# Altium schematic sheet Э3_2.SchDoc
size 420 x 297 mm; SheetNumber: 2; Scale: 1:1; DocumentType: Схема электрическая принципиальная
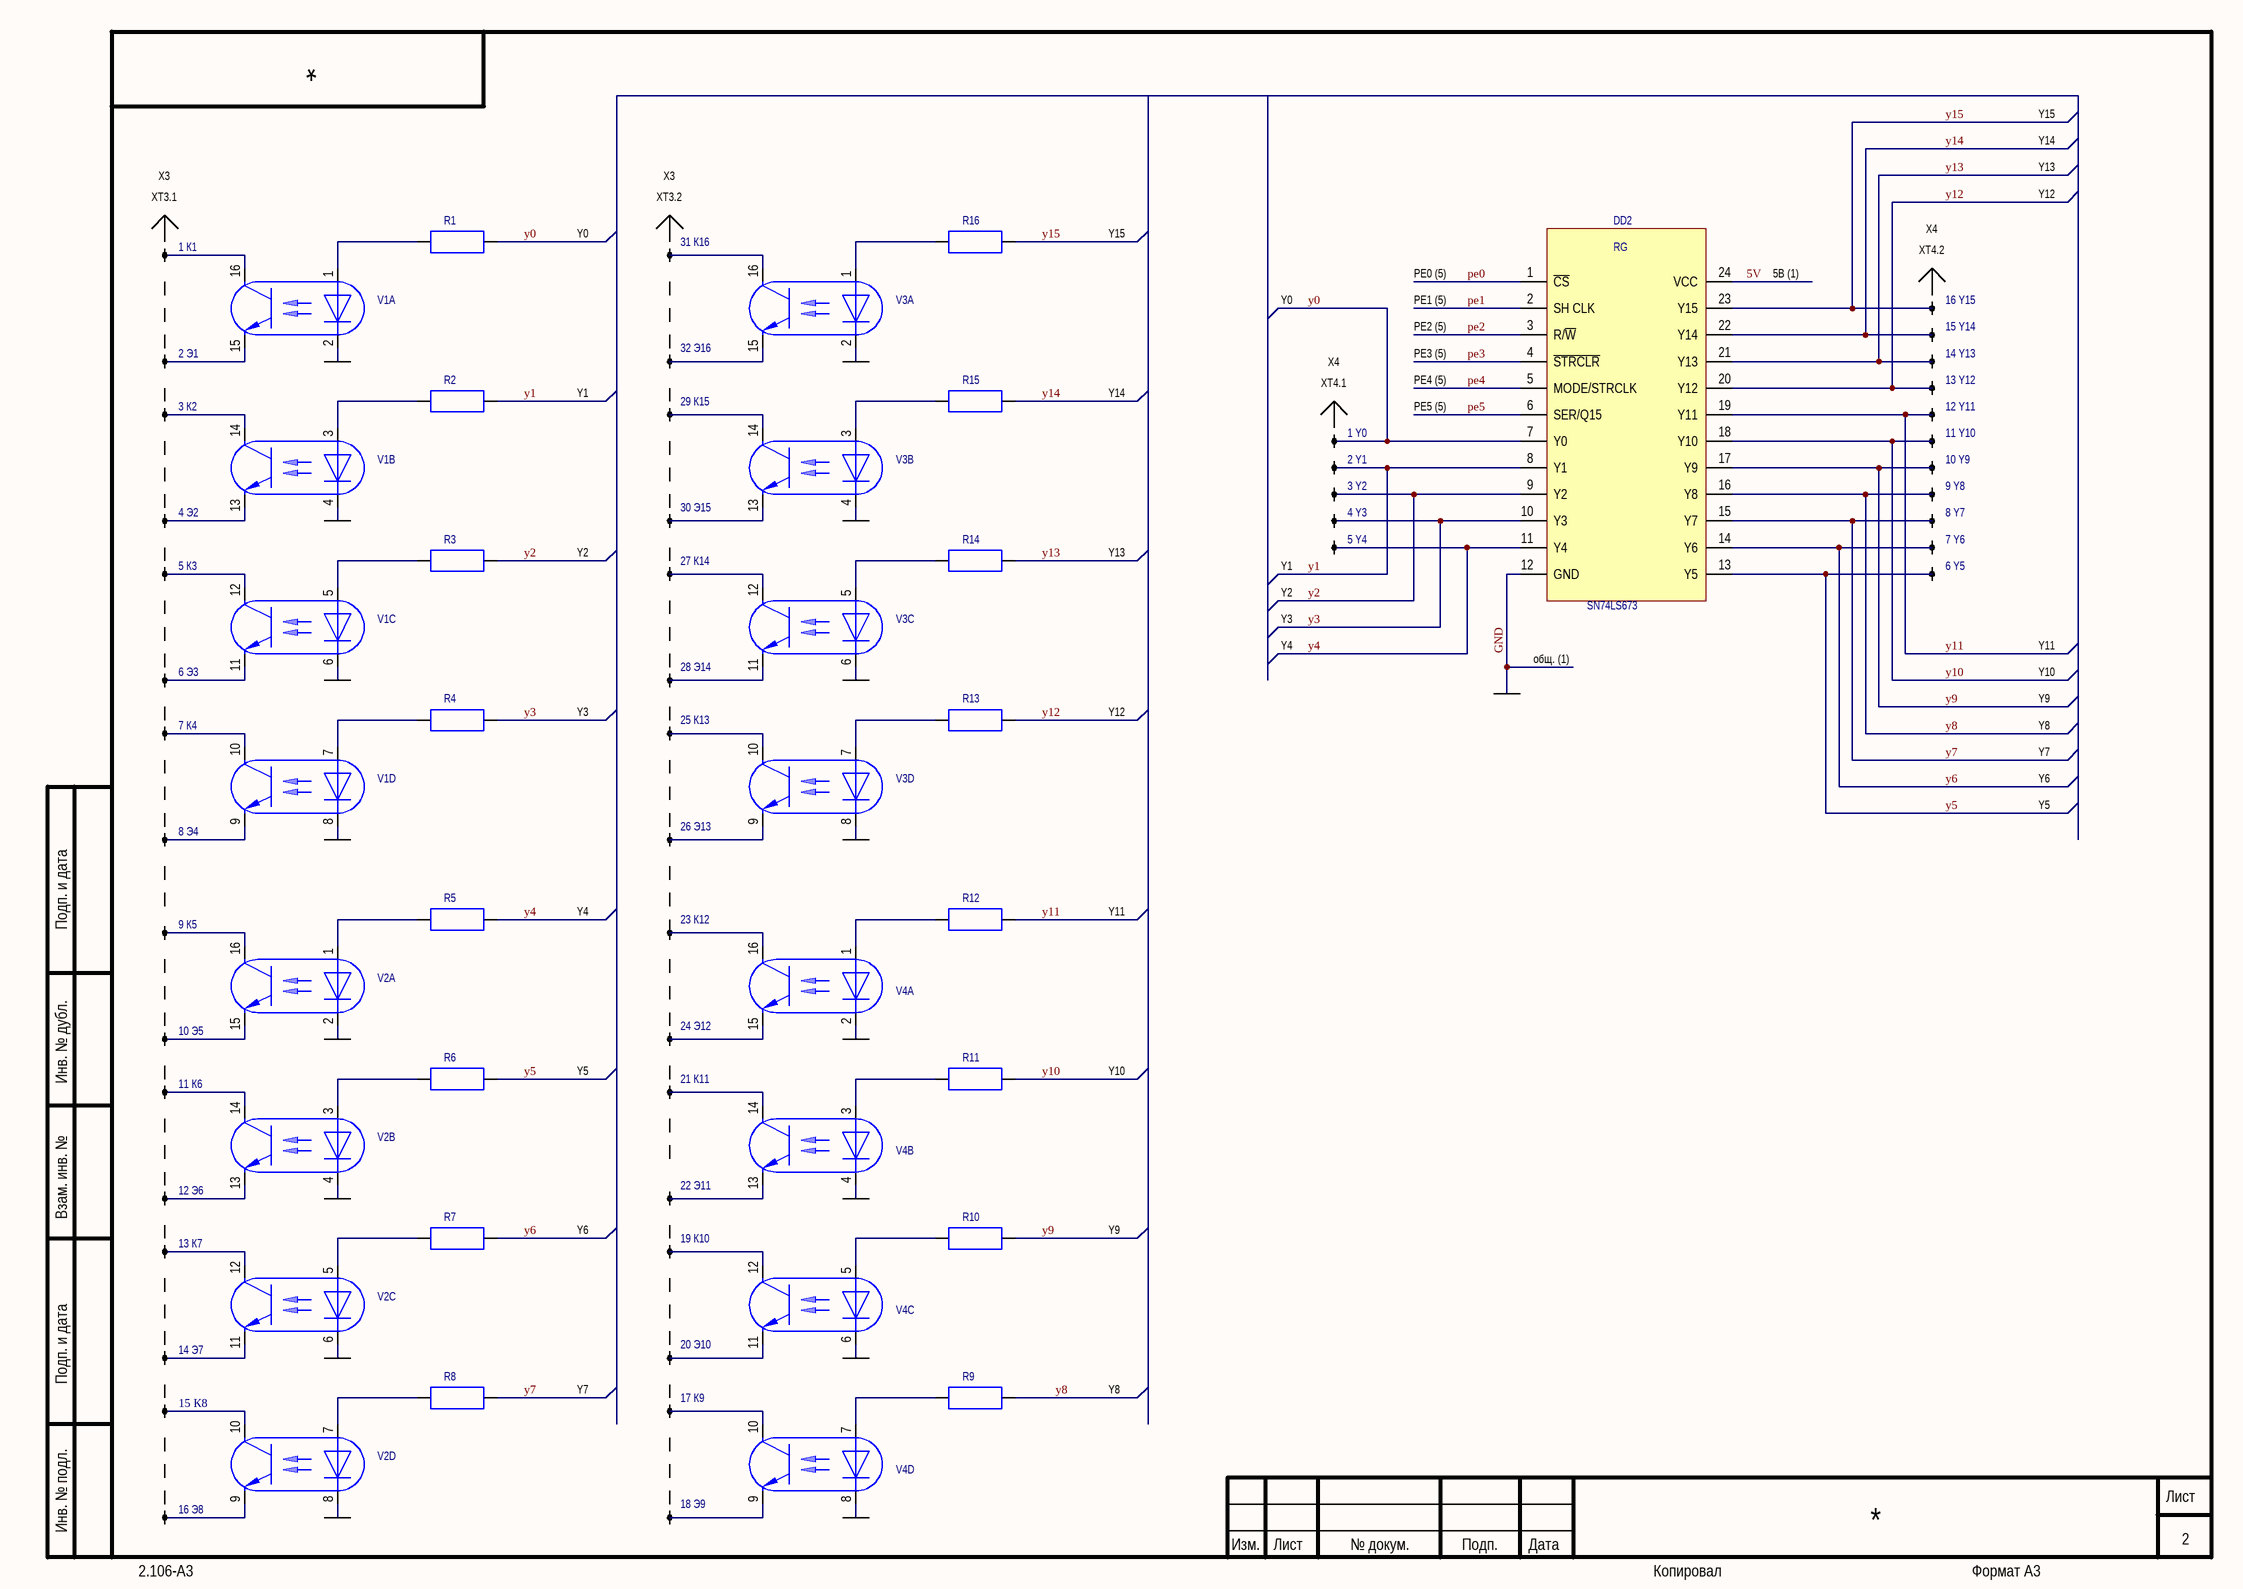
[diagram p0: Э3_2.SchDoc]

## Parts
(Parts that share a designator on the sheet are numbered #1, #2 ... from top to bottom, then left to right.)
DD2  SN74LS673  [SOP127P1030X265-24N]
R1  380 Ом  [RES0805]  (value not drawn)
R2  380 Ом  [RES0805]  (value not drawn)
R3  380 Ом  [RES0805]  (value not drawn)
R4  380 Ом  [RES0805]  (value not drawn)
R5  380 Ом  [RES0805]  (value not drawn)
R6  380 Ом  [RES0805]  (value not drawn)
R7  380 Ом  [RES0805]  (value not drawn)
R8  380 Ом  [RES0805]  (value not drawn)
R9  380 Ом  [RES0805]  (value not drawn)
R10  380 Ом  [RES0805]  (value not drawn)
R11  380 Ом  [RES0805]  (value not drawn)
R12  380 Ом  [RES0805]  (value not drawn)
R13  380 Ом  [RES0805]  (value not drawn)
R14  380 Ом  [RES0805]  (value not drawn)
R15  380 Ом  [RES0805]  (value not drawn)
R16  380 Ом  [RES0805]  (value not drawn)
V1  ACPL247_1  [SOP127P700X220-16N]  (value not drawn)  (parts A,B,C,D of 4)
V2  ACPL247_1  [SOP127P700X220-16N]  (value not drawn)  (parts A,B,C,D of 4)
V3  ACPL247_1  [SOP127P700X220-16N]  (value not drawn)  (parts A,B,C,D of 4)
V4  ACPL247_1  [SOP127P700X220-16N]  (value not drawn)  (parts A,B,C,D of 4)
X3#1  1 К1  [PLD64]  (parts A,B,C,D,H,I,J,K,L,M,N,O,P,Q,R,S,T,U,V,W,X,Y,Z,27,28,29,30,31,32 of 64)
X3#2  5 К3  [PLD64]  (part E of 64)
X3#3  6 Э3  [PLD64]  (part F of 64)
X3#4  7 К4  [PLD64]  (part G of 64)
X4  1 Y0  [PLD40]  (parts A,B,C,D,E,F,G,H,I,J,K,L,M,N,O,P of 40)

## Nets
5V: DD2.24(VCC)
GND: DD2.12(GND)
pe0: DD2.1(~{CS})
pe1: DD2.2(SH_CLK)
pe2: DD2.3(R/~{W})
pe3: DD2.4(~{STRCLR})
pe4: DD2.5(MODE/STRCLK)
pe5: DD2.6(SER/Q15)
y0: DD2.7(Y0) R1.2 X4.1
y1: DD2.8(Y1) R2.2 X4.2
y2: DD2.9(Y2) R3.2 X4.3
y3: DD2.10(Y3) R4.2 X4.4
y4: DD2.11(Y4) R5.2 X4.5
y5: DD2.13(Y5) R6.2 X4.6
y6: DD2.14(Y6) R7.2 X4.7
y7: DD2.15(Y7) R8.2 X4.8
y8: DD2.16(Y8) R9.2 X4.9
y9: DD2.17(Y9) R10.2 X4.10
y10: DD2.18(Y10) R11.2 X4.11
y11: DD2.19(Y11) R12.2 X4.12
y12: DD2.20(Y12) R13.2 X4.13
y13: DD2.21(Y13) R14.2 X4.14
y14: DD2.22(Y14) R15.2 X4.15
y15: DD2.23(Y15) R16.2 X4.16
NetR1_1: R1.1 V1.1
NetR2_1: R2.1 V1.3
NetR3_1: R3.1 V1.5
NetR4_1: R4.1 V1.7
NetR5_1: R5.1 V2.1
NetR6_1: R6.1 V2.3
NetR7_1: R7.1 V2.5
NetR8_1: R8.1 V2.7
NetR9_1: R9.1 V4.7
NetR10_1: R10.1 V4.5
NetR11_1: R11.1 V4.3
NetR12_1: R12.1 V4.1
NetR13_1: R13.1 V3.7
NetR14_1: R14.1 V3.5
NetR15_1: R15.1 V3.3
NetR16_1: R16.1 V3.1
NetV1_9: V1.9 X3#1.8
NetV1_10: V1.10 X3#4.43
NetV1_11: V1.11 X3#3.41
NetV1_12: V1.12 X3#2.39
NetV1_13: V1.13 X3#1.4
NetV1_14: V1.14 X3#1.3
NetV1_15: V1.15 X3#1.2
NetV1_16: V1.16 X3#1.1
NetV2_9: V2.9 X3#1.16
NetV2_10: V2.10 X3#1.15
NetV2_11: V2.11 X3#1.14
NetV2_12: V2.12 X3#1.13
NetV2_13: V2.13 X3#1.12
NetV2_14: V2.14 X3#1.11
NetV2_15: V2.15 X3#1.10
NetV2_16: V2.16 X3#1.9
NetV3_9: V3.9 X3#1.26
NetV3_10: V3.10 X3#1.25
NetV3_11: V3.11 X3#1.28
NetV3_12: V3.12 X3#1.27
NetV3_13: V3.13 X3#1.30
NetV3_14: V3.14 X3#1.29
NetV3_15: V3.15 X3#1.32
NetV3_16: V3.16 X3#1.31
NetV4_9: V4.9 X3#1.18
NetV4_10: V4.10 X3#1.17
NetV4_11: V4.11 X3#1.20
NetV4_12: V4.12 X3#1.19
NetV4_13: V4.13 X3#1.22
NetV4_14: V4.14 X3#1.21
NetV4_15: V4.15 X3#1.24
NetV4_16: V4.16 X3#1.23

Not connected (* = marked no-connect by the designer): V1 2 4 6 8; V2 2 4 6 8; V3 2 4 6 8; V4 2 4 6 8

## Notes on the sheet
- Y15
- (near X3#1) XT3.1
- X3
- (near X3#1) XT3.2
- Y13
- Y14
- Y0
- (near X4) XT4.2
- X4
- Y12
- PE0 (5)
- PE1 (5)
- PE2 (5)
- 5В (1)
- Y1
- (near X4) XT4.1
- PE3 (5)
- PE4 (5)
- PE5 (5)
- Y2
- (near X4) Y1
- Y3
- Y4
- общ. (1)
- Y11
- Y8
- Y9
- Y10
- Y6
- Y7
- Y5
- Подп. и дата
- Инв. № дубл.
- Взам. инв. №
- Инв. № подл.
- Изм.
- Лист
- № докум.
- Подп.
- Дата
- 2.106-A3
- Копировал
- Формат А3
- (in symbol SN74LS673) RG

## Library data of the parts
R1-R16 = R
X3#1-X3#4 = PLD64
X4 = PLD40